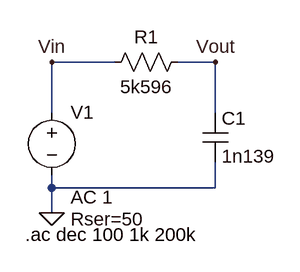
[diagram p0: schematic Draft2.asc]
Draft2.asc, the LTspice schematic file:
Version 4
SHEET 1 880 680
WIRE 128 32 48 32
WIRE 256 32 208 32
WIRE 48 96 48 32
WIRE 256 96 256 32
WIRE 48 192 48 176
WIRE 256 192 256 160
WIRE 256 192 48 192
WIRE 48 224 48 192
FLAG 48 224 0
FLAG 48 32 Vin
FLAG 256 32 Vout
SYMBOL voltage 48 80 R0
WINDOW 123 24 124 Left 2
WINDOW 39 24 152 Left 2
SYMATTR InstName V1
SYMATTR Value ""
SYMATTR Value2 AC 1
SYMATTR SpiceLine Rser=50
SYMBOL res 224 16 R90
WINDOW 0 0 56 VBottom 2
WINDOW 3 32 56 VTop 2
SYMATTR InstName R1
SYMATTR Value 5k596
SYMBOL cap 240 96 R0
SYMATTR InstName C1
SYMATTR Value 1n139
TEXT 14 252 Left 2 !.ac dec 100 1k 200k

The netlist it stands for:
* Draft2.asc
V1 Vin 0 AC 1 Rser=50
R1 Vout Vin 5k596
C1 Vout 0 1n139
.ac dec 100 1k 200k
.backanno
.end

* Results of the author's LTspice run, read from the files saved beside the schematic
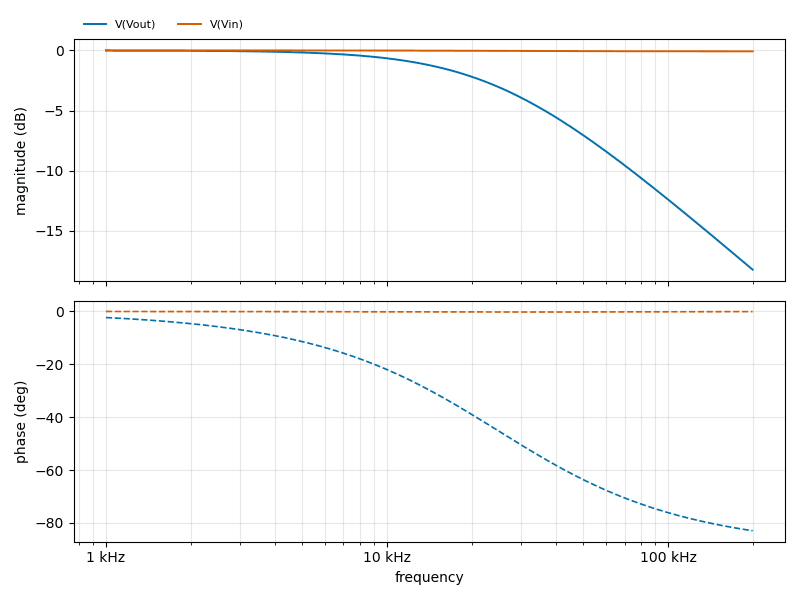
[diagram p1: AC Analysis of Draft2.asc, plotted from the saved traces]
* AC Analysis, 1 run:
*   V(Vout): -0.01 dB at 1 kHz, -18.22 dB at 200 kHz, peak -0.01 dB at 1 kHz, 3 dB below the peak at 24.79 kHz
*   V(Vin): -0.00 dB at 1 kHz, -0.08 dB at 200 kHz, peak -0.00 dB at 1 kHz